# Altium schematic sheet USB2.SchDoc
size D; SheetNumber: 6; SheetTotal: 6
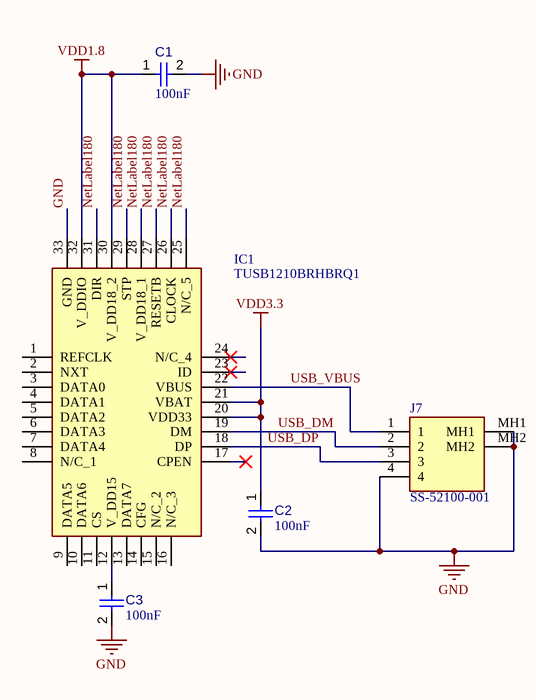
[diagram p0: USB2.SchDoc]

## Parts
C1  value 100nF  [CAPC0402(1005)60_L]  (hidden comment: Capacitor 100nF +/-20% 25V 0402)
C2  value 100nF  [CAPC0402(1005)60_L]  (hidden comment: Capacitor 100nF +/-20% 25V 0402)
C3  value 100nF  [CAPC0402(1005)60_L]  (hidden comment: Capacitor 100nF +/-20% 25V 0402)
IC1  TUSB1210BRHBRQ1  [QFN50P500X500X100-33N-D]
J7  SS-52100-001  [SS52100001]

## Nets
GND: C1.2 C2.2 C3.2 IC1.33(GND) J7.4 J7.MH1 J7.MH2
VDD1.8: C1.1 IC1.30(V_DD18_2) IC1.32(V_DDIO)
VDD3.3: C2.1 IC1.20(VDD33) IC1.21(VBAT)
NetLabel180: IC1.25(N/C_5) IC1.26(CLOCK) IC1.27(RESETB) IC1.28(V_DD18_1) IC1.29(STP) IC1.31(DIR)
USB_DM: IC1.19(DM) J7.2
USB_DP: IC1.18(DP) J7.3
USB_VBUS: IC1.22(VBUS) J7.1
NetC3_1: C3.1 IC1.12(V_DD15)

Not connected (* = marked no-connect by the designer): IC1 1(REFCLK) 2(NXT) 3(DATA0) 4(DATA1) 5(DATA2) 6(DATA3) 7(DATA4) 8(N/C_1) 9(DATA5) 10(DATA6) 11(CS) 13(DATA7) 14(CFG) 15(N/C_2) 16(N/C_3) 17(CPEN)* 23(ID)* 24(N/C_4)*

## Library data of the parts
C1-C3 = CMP-001-00065-4: Chip Capacitor, 100nF +/-20%, 25V, 0402, Thickness 0.6 mm; Tolerance: 10%; Max Operating Temperature: 85°C; Min Operating Temperature: -55°C; Pins: 2; Voltage Rating: 25V; Mounting Technology: SMT; Case/Package: 0402
IC1 = TUSB1210BRHBRQ1: Integrated Circuit; Manufacturer_Name: Texas Instruments; Datasheet Link: http://www.ti.com/lit/gpn/tusb1210-q1; Height: 1mm; Manufacturer_Part_Number: TUSB1210BRHBRQ1; Mouser Part Number: 595-TUSB1210BRHBRQ1; Mouser Price/Stock: https://www.mouser.co.uk/ProductDetail/Texas-Instruments/TUSB1210BRHBRQ1?qs=asCBFxFfL1RlPU8wgUR4ww%3D%3D; Arrow Part Number: TUSB1210BRHBRQ1; Arrow Price/Stock: https://www.arrow.com/en/products/tusb1210brhbrq1/texas-instruments?utm_currency=USD&region=nac
J7 = SS-52100-001: Connector; Manufacturer_Name: Bel; Datasheet Link: https://www.mouser.com/datasheet/2/643/bel_SS-52100-001-1216592.pdf; Height: 7.9mm; Manufacturer_Part_Number: SS-52100-001; Mouser Part Number: 530-SS-52100-001